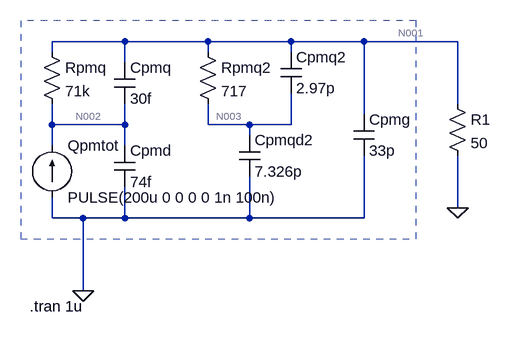
[diagram p0: schematic Draft1.asc]
Draft1.asc, the LTspice schematic file:
Version 4
SHEET 1 880 680
WIRE 192 -16 80 -16
WIRE 320 -16 192 -16
WIRE 448 -16 320 -16
WIRE 560 -16 448 -16
WIRE 704 -16 560 -16
WIRE 80 0 80 -16
WIRE 320 0 320 -16
WIRE 448 0 448 -16
WIRE 192 16 192 -16
WIRE 704 80 704 -16
WIRE 560 96 560 -16
WIRE 80 112 80 80
WIRE 192 112 192 80
WIRE 192 112 80 112
WIRE 320 112 320 80
WIRE 384 112 320 112
WIRE 448 112 448 64
WIRE 448 112 384 112
WIRE 384 128 384 112
WIRE 80 144 80 112
WIRE 192 144 192 112
WIRE 704 240 704 160
WIRE 80 256 80 224
WIRE 128 256 80 256
WIRE 192 256 192 208
WIRE 192 256 128 256
WIRE 384 256 384 192
WIRE 384 256 192 256
WIRE 560 256 560 160
WIRE 560 256 384 256
WIRE 128 368 128 256
FLAG 128 368 0
FLAG 704 240 0
SYMBOL current 80 224 M180
WINDOW 0 24 80 Left 2
WINDOW 3 24 0 Left 2
WINDOW 123 0 0 Left 0
WINDOW 39 0 0 Left 0
SYMATTR InstName Qpmtot
SYMATTR Value PULSE(200u 0 0 0 0 1n 100n)
SYMBOL cap 176 144 R0
SYMATTR InstName Cpmd
SYMATTR Value 74f
SYMBOL cap 176 16 R0
SYMATTR InstName Cpmq
SYMATTR Value 30f
SYMBOL res 64 -16 R0
SYMATTR InstName Rpmq
SYMATTR Value 71k
SYMBOL res 304 -16 R0
SYMATTR InstName Rpmq2
SYMATTR Value 717
SYMBOL cap 432 0 R0
SYMATTR InstName Cpmq2
SYMATTR Value 2.97p
SYMBOL cap 368 128 R0
SYMATTR InstName Cpmqd2
SYMATTR Value 7.326p
SYMBOL cap 544 96 R0
SYMATTR InstName Cpmg
SYMATTR Value 33p
SYMBOL res 688 64 R0
SYMATTR InstName R1
SYMATTR Value 50
TEXT 46 392 Left 2 !.tran 1u
RECTANGLE Normal 640 -48 32 288 2

The netlist it stands for:
* Draft1.asc
I§Qpmtot 0 N002 PULSE(200u 0 0 0 0 1n 100n)
Cpmd N002 0 74f
Cpmq N001 N002 30f
Rpmq N001 N002 71k
Rpmq2 N001 N003 717
Cpmq2 N001 N003 2.97p
Cpmqd2 N003 0 7.326p
Cpmg N001 0 33p
R1 N001 0 50
.tran 1u
.backanno
.end

* Results of the author's LTspice run, read from the files saved beside the schematic
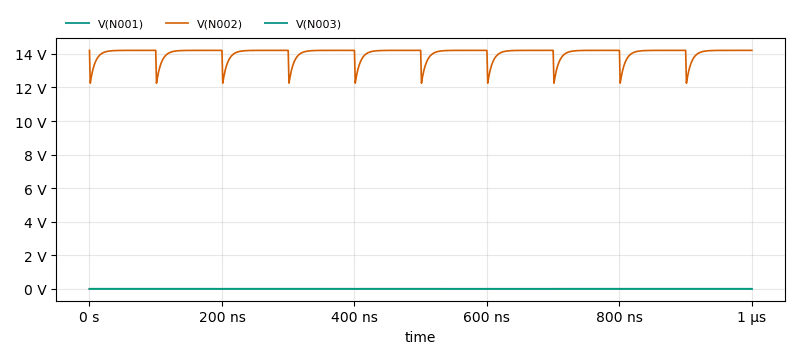
[diagram p1: Transient Analysis of Draft1.asc, plotted from the saved traces]
* Transient Analysis, 1 run:
*   V(N001): min 8.431 mV, max 10 mV, average 9.889 mV, rms 9.893 mV, last 10 mV
*   V(N002): min 12.26 V, max 14.21 V, average 14.05 V, rms 14.06 V, last 14.21 V
*   V(N003): min 9.413 mV, max 10 mV, average 9.89 mV, rms 9.892 mV, last 10 mV